# Altium schematic sheet power.SchDoc
size A4; SheetNumber: 4; SheetTotal: 4
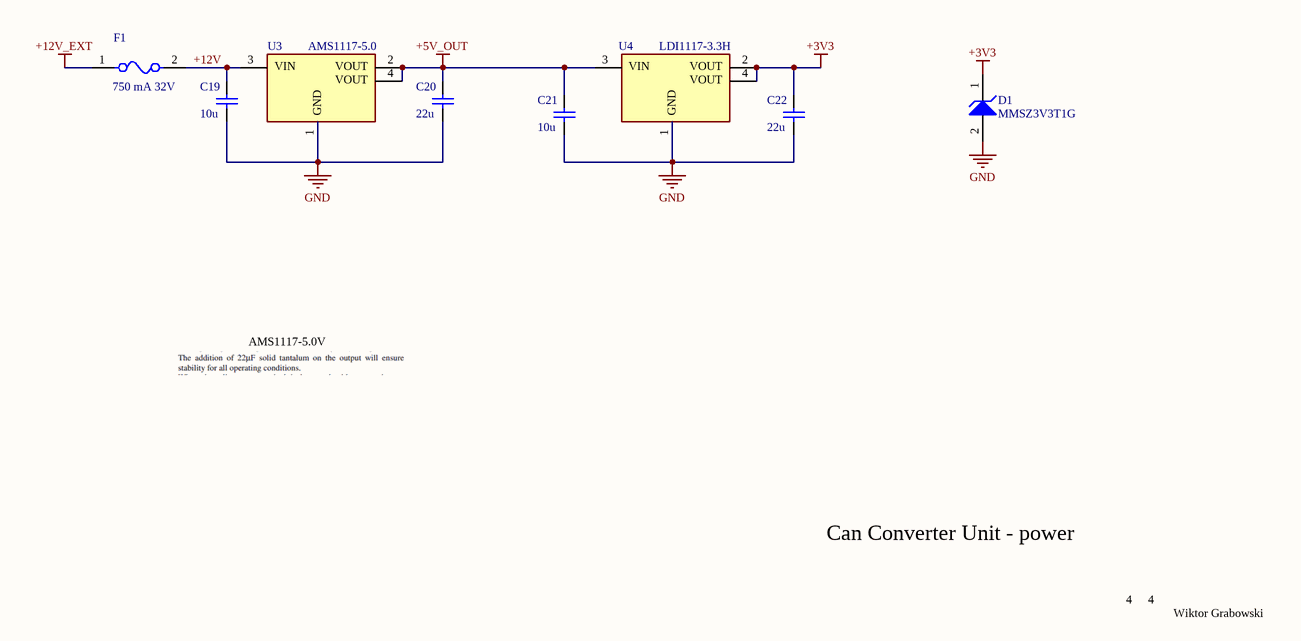
[diagram p0: power.SchDoc]

## Parts
C19  10u  [CAPC1206(3216)170_M]
C20  22u  [CAPC1206(3216)170_M]
C21  10u  [CAPC1206(3216)170_M]
C22  22u  [CAPC1206(3216)170_M]
D1  MMSZ3V3T1G  [ONSC-SOD-123-2-425-04_V]
F1  750 mA 32V  [FP-0466-MFG]
U3  AMS1117-5.0  [AMS1117-5.0]
U4  LDI1117-3.3H  [LDI1117-3.3H]

## Nets
+3V3: C22.2 D1.1(K) U4.2 U4.4
+5V_OUT: C20.2 C21.2 U3.2 U3.4 U4.3
+12V_EXT: F1.1
GND: C19.1 C20.1 C21.1 C22.1 D1.2(A) U3.1 U4.1
+12V: C19.2 F1.2 U3.3

## Notes on the sheet
- AMS1117-5.0V
- Can Converter Unit - power
- 4
- Wiktor Grabowski
- (in symbol AMS1117-5.0) VIN; VOUT; GND
- (in symbol LDI1117-3.3H) VIN; VOUT; GND

## Library data of the parts
C19-C22 = CMP-1037-04008-1: CAP 47nF 200V ±10% 1206 (3216 Metric) Thickness 1.7mm SMD; Tolerance: Â±10%; Case-EIA: 1206; Case-Metric: 3216; Technology: SMT; Max Thickness: 1.7 mm; Value: 47nF; Rated Voltage: 200 V
D1 = CMP-1060-00515-1: Zener Voltage Regulator, 500 mW, 2-Pin SOD-123, Pb-Free, Tape and Reel; Manufacturer: On Semiconductor; P Max (W): 0.5; ComponentLink3URL: http://www.onsemi.com/pub_link/Collateral/425-04.PDF; ComponentLink2Description: Datasheet; DatasheetVersion: Rev. 11; ComponentLink1URL: http://www.onsemi.com/; PackageDescription: 2-Pin SOD, Body 1.6 x 2.69 mm; Mounting Technology: Surface Mount; ComponentLink3Description: Package Specification; ComponentLink1Description: Manufacturer URL; Packing: Tape and Reel; ComponentLink2URL: http://www.onsemi.com/pub_link/Collateral/MMSZ2V4T1-D.PDF; PartNumber: MMSZ3V3T1G; PackageReference: SOD-123-2-425-04; PackageVersion: Rev. G, 10/2009; RoHS: Pb-Free
F1 = CMP-08605-000088-1: FUSE BOARD MOUNT 750MA 63VAC/VDC; Voltage Rating (AC): 63V; Approvals: UL; Fuse Type: Board Mount (Cartridge Style Excluded); DC Cold Resistance: 111mR; Power Dissipation: 74mW; Case Code (Imperial): 1206; Case Code (Metric): 3216; Length: 3.18mm; Height: 0.023inch; Housing Material: Ceramic; Series: SlimLine™ 466; Voltage Rating (DC): 63V; Current Rating: 750mA; Min Operating Temperature: -50°C; Width: 0.06inch; Packaging: Tape and Reel; Depth: 1.52mm; Case/Package: 1206; Mount: Surface Mount; Max Operating Temperature: 90°C; Package Quantity: 5000; RoHS Compliant: Yes; Lead Free: Lead Free
U3 = AMS1117-5.0: 1A LOW DROPOUT VOLTAGE REGULATOR; Manufacturer_Name: Advanced Monolithic Systems; Geometry.Height: 1.8mm; Manufacturer_Part_Number: AMS1117-5.0; Mouser Part Number: *; Mouser Price/Stock: *; Arrow Part Number: *; Arrow Price/Stock: *; Datasheet Link: http://www.advanced-monolithic.com/pdf/ds1117.pdf
U4 = LDI1117-3.3H: Fixed Positive LDO Regulator; Manufacturer: Diotec; Supplier: Mouser; Supplier Part Number: 637-LDI1117-3.3H; Manufacturer Part Number: LDI1117-3.3H; RoHS: No; Category: Voltage Regulators - Linear; Stock: 5056; Pricing: 1=0,4, 10=0,286, 50=0,286, 100=0,199, 1000=0,163, 10000=0,089 (USD); ComponentLink1URL: https://datasheet.octopart.com/LDI1117-3.3H-Diotec-datasheet-154607892.pdf?src-supplier=TME; ComponentLink1Description: https://datasheet.octopart.com/LDI1117-3.3H-Diotec-datasheet-154607892.pdf?src-supplier=TME; ComponentLink2URL: https://datasheet.octopart.com/LDI1117-3.3H-Diotec-datasheet-159101088.pdf?src-supplier=SOS+electronic; ComponentLink2Description: https://datasheet.octopart.com/LDI1117-3.3H-Diotec-datasheet-159101088.pdf?src-supplier=SOS+electronic; ComponentLink3URL: https://datasheet.octopart.com/LDI1117-3.3H-Diotec-datasheet-189099648.pdf?src-supplier=Master+Electronics; ComponentLink3Description: https://datasheet.octopart.com/LDI1117-3.3H-Diotec-datasheet-189099648.pdf?src-supplier=Master+Electronics